# EAGLE design PFet_Breakout (EAGLE 6.5.0)
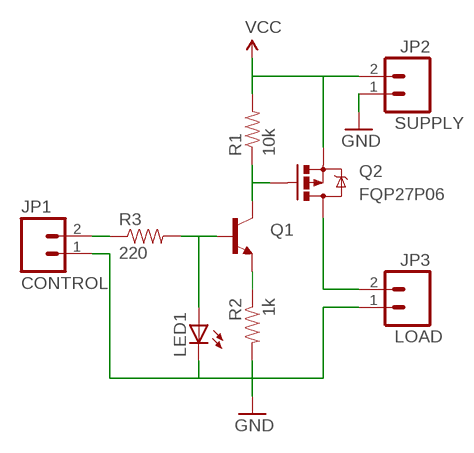
[diagram p0: schematic, sheet 1]

## Parts
JP1  M02PTH  [1X02]
JP2  M023.5MM  [SCREWTERMINAL-3.5MM-2]
JP3  M023.5MM  [SCREWTERMINAL-3.5MM-2]
LED1  LED5MM  [LED5MM]
Q1  TRANSISTOR_NPNP2N2222A  [TO-92]
Q2  MOSFET-PCHANNELFQP27P06  [TO220V]
R1  10k  RESISTORAXIAL-0.3  [AXIAL-0.3]
R2  1k  RESISTORAXIAL-0.3  [AXIAL-0.3]
R3  220  RESISTORAXIAL-0.3  [AXIAL-0.3]

## Nets
GND: JP1.1 JP2.1 JP3.1 LED1.K(C) R2.P$2
N$1: Q1.3(E) R2.P$1
N$2: LED1.A Q1.2(B) R3.P$2
N$3: JP1.2 R3.P$1
N$4: JP3.2 Q2.2(D)
N$5: Q1.1(C) Q2.1(G) R1.P$1
VCC: JP2.2 Q2.3(S) R1.P$2

## Notes on the sheet
- SUPPLY
- FQP27P06
- CONTROL
- LOAD

## Library data of the parts
JP1-JP3 = SparkFun-Connectors:M02: Standard 2-pin 0.1" header. Use with - straight break away headers ( PRT-00116) - right angle break away headers (PRT-00553) - swiss pins (PRT-00743) - machine pins (PRT-00117) - female headers (PRT-00115) Molex polarized connector foot print use with: PRT-08233 with associated crimp pins and housings. 2.54_SCREWTERM for use with PRT-10571. 3.5mm Screw Terminal footprints for PRT-08084 5mm Screw Terminal footprints for use with PRT-08433
LED1 = SparkFun-LED:LED: LEDs Standard schematic elements and footprints for 5mm, 3mm, 1206, and 0603 sized LEDs. 5mm - Spark Fun Electronics SKU : COM-00529 (and others)
Q1 = SparkFun-DiscreteSemi:TRANSISTOR_NPN: Generic NPN BJT MMBT2222A - TRANS-08049 (SOT-23, 1A 40V) MPSA42 - TRANS-09116 (SOT-23, 500mA 300V) MMBT5088LT1G - TRANS-11160 (SOT-23, 50 mA 30V) BC547 - COM-08928 <http://www.sparkfun.com/products/8928> (TO-92 45V 100mA) (1.Collector 2.Base 3.Emitter) 2N3904 - COM-00521 <http://www.sparkfun.com/products/521> (TO-92 40V 200mA) (1.Emitter 2.Base 3.Collector) P2N2222A - COM-12852 <http://www.sparkfun.com/products/12852> (TO-92 40V 600mA) (1.Collector 2.Base 3.Emitter)
Q2 = SparkFun-DiscreteSemi:MOSFET-PCHANNEL: Generic PMOSFET IRLML2244 - TRANS-11153 (SOT-23 -20V -4.3A) (1.Gate 2.Source 3.Drain) FQP27P06 - COM-10349 <http://www.sparkfun.com/products/10349> (TO-220 -60V -27A) (1.Gate 2.Source 3.Drain)
R1-R3 = SparkFun-Resistors:RESISTOR: Resistor Basic schematic elements and footprints for 0603, 1206, and PTH resistors.

## Board
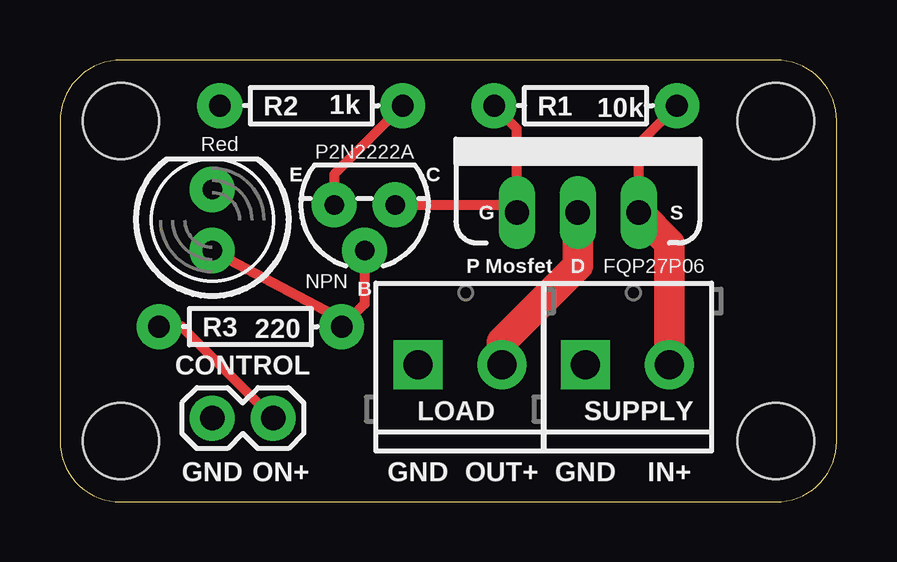
[diagram p1: board, top side]
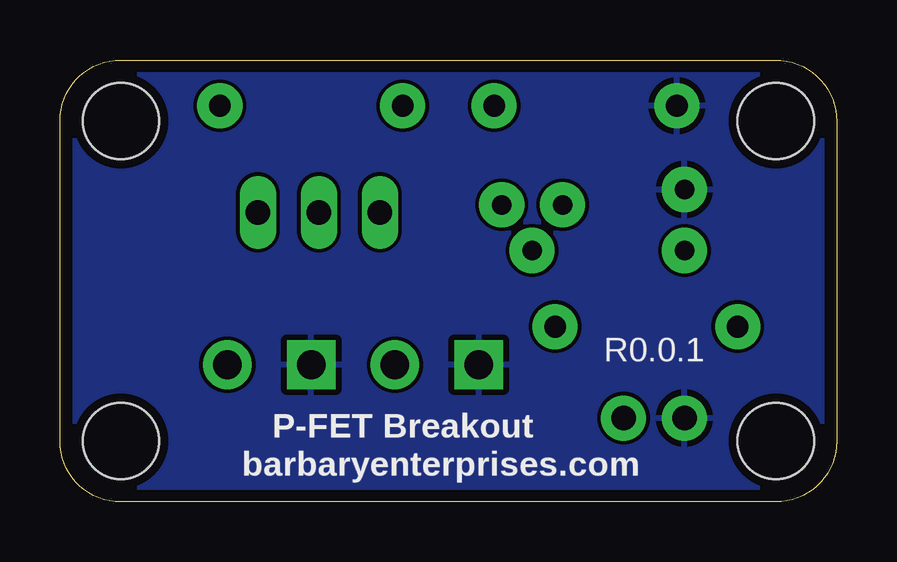
[diagram p2: board, bottom side, seen from below]

Size 32.38 x 18.41 mm. Coordinates in mm from the lower left corner, seen from the top.
Outline: 2.54,0 29.84,0 arc90 32.38,2.54 32.38,15.88 arc90 29.84,18.41 2.56,18.41 arc90 0,15.86 0,2.54 arc90 2.54,0
Copper layers (1*16): Top 0.0356mm / dielectric 1.5011mm / Bottom 0.0356mm
Design rules "LaenPCBOrder": minimum track width 6mil, minimum drill 13mil, track to track 6mil, track to pad 6mil, pad to pad 6mil, via to via 6mil, smd to smd 6mil, copper to edge 15mil, drill to drill 6mil, minimum pad ring 7mil, minimum via ring 7mil, stop-mask expansion 3mil, vias tented up to drill 0mil, thermal gap 10mil
Holes 3.17 mm at 2.54,2.54 2.54,15.88 29.84,2.54 29.84,15.88

### Footprints (pad centres in the part's own frame; a part is rotated, then mirrored left to right if it is on the bottom)
1X02 = drill 1.016 pad 1.88: 1 0,0; 2 2.54,0
SCREWTERMINAL-3.5MM-2 = drill 1.2 pad 2.032 square: 1 0,0 | drill 1.2 pad 2.032: 2 3.5,0
LED5MM = drill 0.813 pad 1.88: A -1.27,0; K 1.27,0
TO-92 = drill 0.813 pad 1.88: 1 -1.27,0; 2 0,1.905; 3 1.27,0
TO220V = drill 1.016 long: 1 -2.54,0; 2 0,0; 3 2.54,0
AXIAL-0.3 = drill 0.9 pad 1.88: P$1 -3.81,0; P$2 3.81,0

### Placement (x,y rotation side)
JP1  6.35,3.49 0 top
JP2  21.91,5.71 0 top
JP3  14.92,5.71 0 top
LED1  6.35,11.75 90 top
Q1  12.7,12.38 180 top
Q2  21.59,12.06 0 top
R1  21.91,16.51 0 top
R2  10.48,16.51 180 top
R3  7.94,7.3 0 top

### Tracks (layer width: path | path; a pad name or v marks a point on that pad's centre or on a via)
GND
  pour Bottom: 0.64,0.64 0.64,17.78 31.75,17.78 31.75,0.64
N$1
  Top 0.406: R2.P$1 11.43,13.65 Q1.3
N$2
  Top 0.406: LED1.A 11.75,7.62 R3.P$2 12.7,8.26 Q1.2
N$3
  Top 0.406: JP1.2 5.08,7.3 R3.P$1
N$4
  Top 1.27: JP3.2 18.42,6.67 21.59,9.84 Q2.2
N$5
  Top 0.406: R1.P$1 19.05,15.56 Q2.1 18.73,12.38 Q1.1
VCC
  Top 0.406: Q2.3 24.13,14.92 R1.P$2
  Top 1.27: JP2.2 25.41,10.79 Q2.3

### Text on the board
tPlace: R2 | R1 | Red | P2N2222A | E | C | G | S | P Mosfet | D | FQP27P06 | NPN | B | R3 | CONTROL | LOAD | SUPPLY | GND | ON+ | GND | OUT+ | GND | IN+
bPlace: R0.0.1 | P-FET Breakout | barbaryenterprises.com